# Altium project Super_Hornet_1.0.PrjPcb (part 5 of 5)
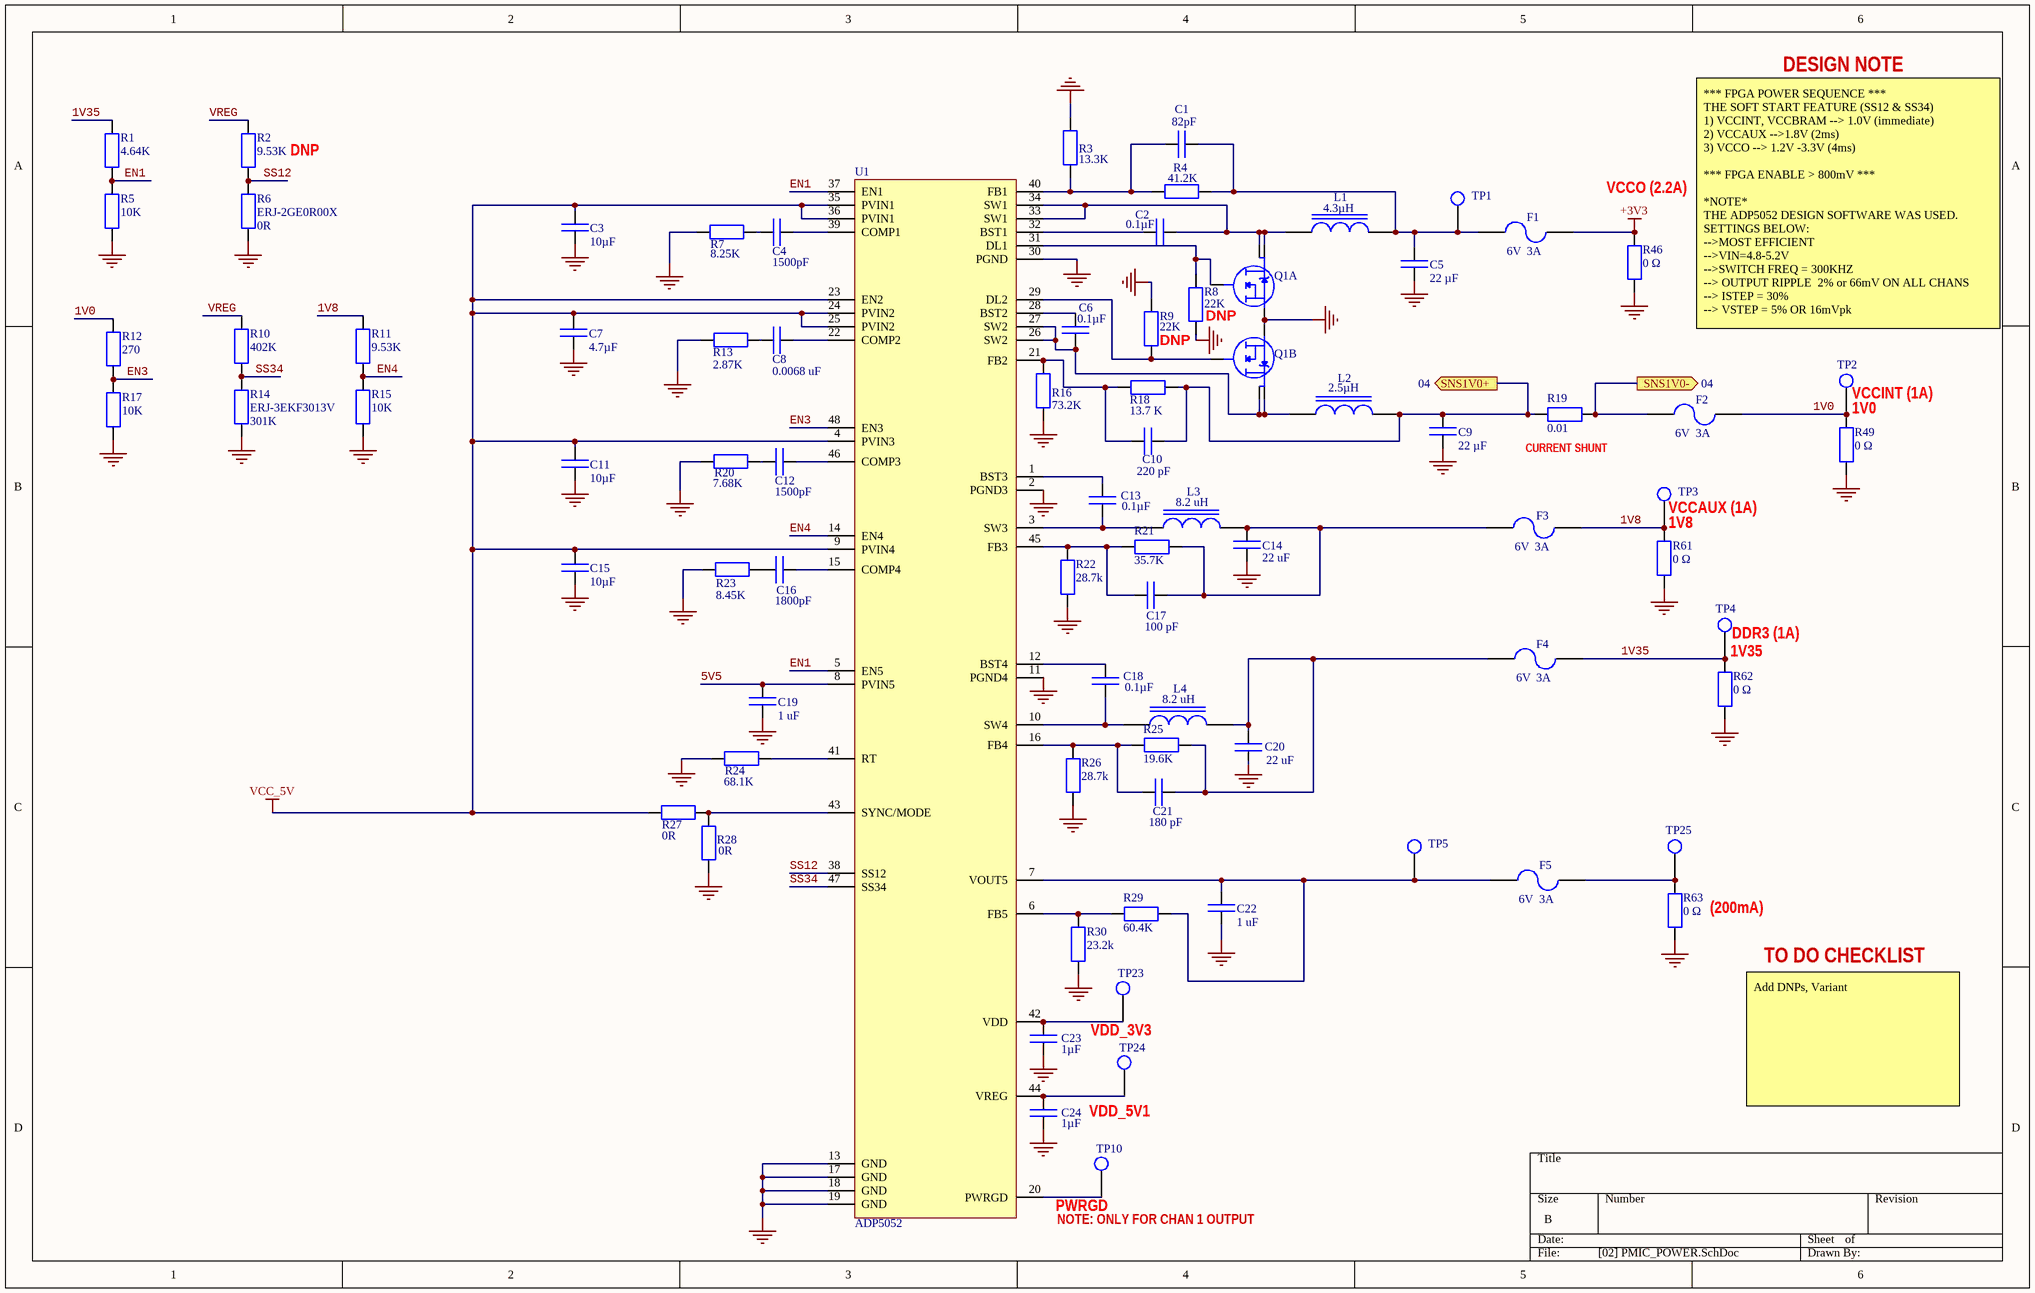
[diagram p6: [02] PMIC_POWER.SchDoc]

## Sheet [02] PMIC_POWER.SchDoc (continued)

### Library data of the parts (continued)
R13 = RC0805FR-072K87L: RES SMD 2.87K OHM 1% 1/8W 0805; Manufacturer: Yageo; Product Training Modules: Chip Resistor; Catalog Drawings: Thick Film Resistor Side; PCN Other: RC/AC 0603/0805/1206 22/Jan/2013; HTML Datasheet: RC Series, L Suffix Datasheet.html; EDA / CAD Models: Download from Accelerated Designs; Power (Watts): 0.125W, 1/8W; Temperature Coefficient: ±100ppm/°C; Online Catalog: RC0805 Series; Kits: PHC4A-KIT-ND  - RES KIT 1K-9.76K 1/8W 5700PCS PHC4-KIT-ND  - RES KIT 1K-9.76K 1/8W 22800PCS; Other Names: 311-2.87KCRCT; Supplier 1: Digi-Key; Manufacturer Part Number: RC0805FR-072K87L; Stock 1: 149027; Pricing 1: 1=0.1, 10=0.04, 100=0.0163, 1000=0.0073, 2500=0.0064 (USD); Standard Package: 1; Category: Resistors; Family: Chip Resistor - Surface Mount; Series: RC; Packaging: Cut Tape (CT); Tolerance: ±1%; Composition: Thick Film; Features: Moisture Resistant; Operating Temperature: -55°C ~ 155°C; Package / Case: 0805 (2012 Metric); Supplier Device Package: 0805; Size / Dimension: 0.079" L x 0.049" W (2.00mm x 1.25mm); Height: 0.024" (0.60mm); Number of Terminations: 2; ComponentLink1URL: http://www.yageo.ru/pdf/RC0805.pdf?src-supplier=Future+Electronics; ComponentLink1Description: http://www.yageo.ru/pdf/RC0805.pdf?src-supplier=Future+Electronics; ComponentLink2URL: http://www.yageo.com.tw/exep/pages/download/literatures/PYu-R_INT-thick_7.pdf?src-supplier=Digi-Key; ComponentLink2Description: http://www.yageo.com.tw/exep/pages/download/literatures/PYu-R_INT-thick_7.pdf?src-supplier=Digi-Key; ComponentLink3URL: http://www.yageo.com/documents/recent/PYu-RC_Group_51_RoHS_L_9.pdf?src-supplier=Digi-Key; ComponentLink3Description: http://www.yageo.com/documents/recent/PYu-RC_Group_51_RoHS_L_9.pdf?src-supplier=Digi-Key; Supplier Part Number 1: 311-2.87KCRCT-ND
R14 = ERJ-3EKF3013V: RES SMD 301K OHM 1% 1/10W 0603; Manufacturer: Panasonic; Resistor Element Type: Thick Film; Temperature Coefficient: ± 100ppm/°C; SVHC: To Be Advised; Product Range: PANASONIC - ERJ Series Thick Film Chip Resistors; Power Rating: 100mW; Resistor Case Style: 0603 ^1608 Metric]; Voltage Rating: 75V; Supplier 1: Digi-Key; Manufacturer Part Number: ERJ-3EKF3013V; Stock 1: 56159; Pricing 1: 1=0.1, 10=0.05, 100=0.0205, 1000=0.0092, 2500=0.008 (USD); Packaging: Full Reel; Resistance Tolerance: ± 1%; ComponentLink1URL: http://www.jameco.com/Jameco/Products/ProdDS/1987951.pdf?src-supplier=Jameco; ComponentLink1Description: http://www.jameco.com/Jameco/Products/ProdDS/1987951.pdf?src-supplier=Jameco; ComponentLink2URL: http://industrial.panasonic.com/www-data/pdf/AOA0000/AOA0000CE2.pdf?src-supplier=Avnet; ComponentLink2Description: http://industrial.panasonic.com/www-data/pdf/AOA0000/AOA0000CE2.pdf?src-supplier=Avnet; ComponentLink3URL: https://www.alliedelec.com/m/d/623f45ff1957d936ff56d46fd1c28cac.pdf?src-supplier=Allied+Electronics; ComponentLink3Description: https://www.alliedelec.com/m/d/623f45ff1957d936ff56d46fd1c28cac.pdf?src-supplier=Allied+Electronics; ComponentLink4URL: http://www.farnell.com/datasheets/426256.pdf?src-supplier=Element14; ComponentLink4Description: http://www.farnell.com/datasheets/426256.pdf?src-supplier=Element14; ComponentLink5URL: http://www.farnell.com/datasheets/1678782.pdf?src-supplier=Element14; ComponentLink5Description: http://www.farnell.com/datasheets/1678782.pdf?src-supplier=Element14; ComponentLink6URL: http://www.farnell.com/datasheets/426256.pdf?src-supplier=Farnell; ComponentLink6Description: http://www.farnell.com/datasheets/426256.pdf?src-supplier=Farnell; ComponentLink7URL: http://www.mouser.com/ds/2/315/AOA0000C283-1093288.pdf?src-supplier=Mouser; ComponentLink7Description: http://www.mouser.com/ds/2/315/AOA0000C283-1093288.pdf?src-supplier=Mouser; Supplier Part Number 1: P301KHCT-ND
R16 = ERJ-2RKF7322X: RES SMD 73.2K OHM 1% 1/10W 0402; Manufacturer: Panasonic; Temperature Coefficient: ± 100ppm/°C; Voltage Rating: 50V; SVHC: To Be Advised; Product Range: PANASONIC - ERJ Series; Power Rating: 100mW; Resistor Case Style: 0402 ^1005 Metric]; Resistor Element Type: Thick Film; Supplier 1: Digi-Key; Manufacturer Part Number: ERJ-2RKF7322X; Stock 1: 75939; Pricing 1: 1=0.1, 10=0.04, 100=0.0164, 1000=0.0074, 2500=0.0064, 5000=0.0053 (USD); Packaging: Full Reel; Resistance Tolerance: ± 1%; ComponentLink1URL: https://www.alliedelec.com/m/d/623f45ff1957d936ff56d46fd1c28cac.pdf?src-supplier=Allied+Electronics; ComponentLink1Description: https://www.alliedelec.com/m/d/623f45ff1957d936ff56d46fd1c28cac.pdf?src-supplier=Allied+Electronics; ComponentLink2URL: http://www.mouser.com/ds/2/315/AOA0000CE2-37512.pdf?src-supplier=Mouser; ComponentLink2Description: http://www.mouser.com/ds/2/315/AOA0000CE2-37512.pdf?src-supplier=Mouser; ComponentLink3URL: http://www.farnell.com/datasheets/1678782.pdf?src-supplier=Element14; ComponentLink3Description: http://www.farnell.com/datasheets/1678782.pdf?src-supplier=Element14; ComponentLink4URL: http://www.industrial.panasonic.com/www-data/pdf/AOA0000/AOA0000CE2.pdf?src-supplier=Element14; ComponentLink4Description: http://www.industrial.panasonic.com/www-data/pdf/AOA0000/AOA0000CE2.pdf?src-supplier=Element14; ComponentLink5URL: http://www.farnell.com/datasheets/1911175.pdf?src-supplier=Farnell; ComponentLink5Description: http://www.farnell.com/datasheets/1911175.pdf?src-supplier=Farnell; Supplier Part Number 1: P73.2KLCT-ND
R18 = ERJ-2RKF1372X: RES SMD 13.7K OHM 1% 1/10W 0402; Manufacturer: Panasonic; Power Rating: 100 mW; Temperature Coefficient: 100 PPM / C; Voltage Rating: 50 V; Qualification: AEC-Q200; Unit Weight: 0.000028 oz; Supplier 1: Digi-Key; Manufacturer Part Number: ERJ-2RKF1372X; Stock 1: 348733; Pricing 1: 1=0.1, 10=0.043, 100=0.0173, 1000=0.0078, 2500=0.0068, 5000=0.0056 (USD); Product Category: Thick Film Resistors; RoHS: True; Tolerance: 1 %; Case Code - in: 0402; Case Code - mm: 1005; Operating Temperature Range: - 55 C to + 155 C; Series: ERJ; Type: Precision Thick Film Resistors SMD; Brand: Panasonic; Height: 0.35 mm; Length: 1 mm; Package / Case: 0402 (1005 metric); Packaging: Reel; Product: Thick Film Resistors SMD; Factory Pack Quantity: 10000; Termination Style: SMD/SMT; Width: 0.5 mm; ComponentLink1URL: http://www.farnell.com/datasheets/1678782.pdf?src-supplier=Element14; ComponentLink1Description: http://www.farnell.com/datasheets/1678782.pdf?src-supplier=Element14; ComponentLink2URL: http://www.farnell.com/datasheets/1694929.pdf?src-supplier=Element14; ComponentLink2Description: http://www.farnell.com/datasheets/1694929.pdf?src-supplier=Element14; ComponentLink3URL: https://www.alliedelec.com/m/d/623f45ff1957d936ff56d46fd1c28cac.pdf?src-supplier=Allied+Electronics; ComponentLink3Description: https://www.alliedelec.com/m/d/623f45ff1957d936ff56d46fd1c28cac.pdf?src-supplier=Allied+Electronics; ComponentLink4URL: http://www.farnell.com/datasheets/1678782.pdf?src-supplier=Farnell; ComponentLink4Description: http://www.farnell.com/datasheets/1678782.pdf?src-supplier=Farnell; ComponentLink5URL: http://industrial.panasonic.com/www-data/pdf/AOA0000/AOA0000CE2.pdf?src-supplier=Avnet; ComponentLink5Description: http://industrial.panasonic.com/www-data/pdf/AOA0000/AOA0000CE2.pdf?src-supplier=Avnet; ComponentLink6URL: http://www.mouser.com/ds/2/315/AOA0000C304-1149620.pdf?src-supplier=Mouser; ComponentLink6Description: http://www.mouser.com/ds/2/315/AOA0000C304-1149620.pdf?src-supplier=Mouser; Supplier Part Number 1: P13.7KLCT-ND
R19 = ERJ-3LWFR010V: RES SMD 0.01 OHM 1% 1/4W 0603; Manufacturer: Panasonic; Power (Watts): 0.25W, 1/4W; Temperature Coefficient: 0/ +300ppm/°C; Supplier 1: Digi-Key; Manufacturer Part Number: ERJ-3LWFR010V; Stock 1: 48216; Pricing 1: 1=0.48, 10=0.371, 100=0.156, 1000=0.0861, 2500=0.0807 (USD); Category: Resistors; Family: Chip Resistor - Surface Mount; Series: ERJ; Packaging: Tape & Reel (TR); Tolerance: ±1%; Composition: Thick Film; Features: Automotive AEC-Q200, Current Sense; Operating Temperature: -55°C ~ 125°C; Package / Case: 0603 (1608 Metric); Supplier Device Package: 0603; Size / Dimension: 0.063" L x 0.031" W (1.60mm x 0.80mm); Height: 0.026" (0.65mm); Number of Terminations: 2; ComponentLink1URL: https://industrial.panasonic.com/cdbs/www-data/pdf/RDN0000/AOA0000C313.pdf?src-supplier=Digi-Key; ComponentLink1Description: https://industrial.panasonic.com/cdbs/www-data/pdf/RDN0000/AOA0000C313.pdf?src-supplier=Digi-Key; ComponentLink2URL: http://industrial.panasonic.com/lecs/www-data/pdf/AOA0000/AOA0000CE3.pdf?src-supplier=Digi-Key; ComponentLink2Description: http://industrial.panasonic.com/lecs/www-data/pdf/AOA0000/AOA0000CE3.pdf?src-supplier=Digi-Key; ComponentLink3URL: http://www.mouser.com/ds/2/315/AOA0000C295-1109214.pdf?src-supplier=Mouser; ComponentLink3Description: http://www.mouser.com/ds/2/315/AOA0000C295-1109214.pdf?src-supplier=Mouser; Supplier Part Number 1: P19180CT-ND
R20 = ERJ-6ENF7681V: RES SMD 7.68K OHM 1% 1/8W 0805; Manufacturer: Panasonic; EDA / CAD Models: Download from Accelerated Designs; Power (Watts): 0.125W, 1/8W; Temperature Coefficient: ±100ppm/°C; Online Catalog: ERJ Series; Kits: RSM3CA-ND  - RES KIT 1K-9.76K 1/8W 4800PCS RSM3C-ND  - RES KIT 1K-9.76K 1/8W 19200PCS; Other Names: ERJ-6ENF7681 ERJ6ENF7681 P7.68KCBK P7.68KCCT; Supplier 1: Digi-Key; Manufacturer Part Number: ERJ-6ENF7681V; Stock 1: 41002; Pricing 1: 1=0.1, 10=0.072, 100=0.0275, 1000=0.0121, 2500=0.0105 (USD); Standard Package: 1; Category: Resistors; Family: Chip Resistor - Surface Mount; Series: ERJ; Packaging: Cut Tape (CT); Tolerance: ±1%; Composition: Thick Film; Features: Automotive AEC-Q200; Operating Temperature: -55°C ~ 155°C; Package / Case: 0805 (2012 Metric); Supplier Device Package: 0805; Size / Dimension: 0.079" L x 0.049" W (2.00mm x 1.25mm); Height: 0.028" (0.70mm); Number of Terminations: 2; ComponentLink1URL: http://www.mouser.com/ds/2/315/AOA0000C283-1093288.pdf?src-supplier=Mouser; ComponentLink1Description: http://www.mouser.com/ds/2/315/AOA0000C283-1093288.pdf?src-supplier=Mouser; ComponentLink2URL: https://www.alliedelec.com/m/d/623f45ff1957d936ff56d46fd1c28cac.pdf?src-supplier=Allied+Electronics; ComponentLink2Description: https://www.alliedelec.com/m/d/623f45ff1957d936ff56d46fd1c28cac.pdf?src-supplier=Allied+Electronics; ComponentLink3URL: http://www.farnell.com/datasheets/1678782.pdf?src-supplier=Farnell; ComponentLink3Description: http://www.farnell.com/datasheets/1678782.pdf?src-supplier=Farnell; ComponentLink4URL: http://industrial.panasonic.com/www-data/pdf/AOA0000/AOA0000CE2.pdf?src-supplier=Avnet; ComponentLink4Description: http://industrial.panasonic.com/www-data/pdf/AOA0000/AOA0000CE2.pdf?src-supplier=Avnet; ComponentLink5URL: http://www.farnell.com/datasheets/1694929.pdf?src-supplier=Element14; ComponentLink5Description: http://www.farnell.com/datasheets/1694929.pdf?src-supplier=Element14; Supplier Part Number 1: P7.68KCCT-ND
R21 = ERJ-2RKF3572X: RES SMD 35.7K OHM 1% 1/10W 0402; Manufacturer: Panasonic; Resistor Element Type: Thick Film; Product Range: PANASONIC - ERJ Series; Power Rating: 100mW; Resistor Case Style: 0402 [1005 Metric]; Temperature Coefficient: ± 100ppm/°C; Voltage Rating: 50V; SVHC: Diboron trioxide (19-Dec-2012); Resistor Terminals: Wraparound; SVHC (Secondary): Lead monoxide (lead oxide) (19-Dec-2012); Supplier 1: Digi-Key; Manufacturer Part Number: ERJ-2RKF3572X; Stock 1: 130211; Pricing 1: 1=0.1, 10=0.038, 100=0.0153, 1000=0.0069, 2500=0.006, 5000=0.0049 (USD); Resistance Tolerance: ± 1%; Resistor Element Material: Thick Film; Packaging: Cut Tape; MSL: (Not Applicable); Resistor Mounting: SMD; ComponentLink1URL: http://industrial.panasonic.com/www-data/pdf/AOA0000/AOA0000CE2.pdf?src-supplier=Avnet; ComponentLink1Description: http://industrial.panasonic.com/www-data/pdf/AOA0000/AOA0000CE2.pdf?src-supplier=Avnet; ComponentLink2URL: http://www.mouser.com/ds/2/315/AOA0000C86-911473.pdf?src-supplier=Mouser; ComponentLink2Description: http://www.mouser.com/ds/2/315/AOA0000C86-911473.pdf?src-supplier=Mouser; ComponentLink3URL: http://www.industrial.panasonic.com/www-data/pdf/AOA0000/AOA0000CE2.pdf?src-supplier=Element14; ComponentLink3Description: http://www.industrial.panasonic.com/www-data/pdf/AOA0000/AOA0000CE2.pdf?src-supplier=Element14; ComponentLink4URL: https://www.alliedelec.com/m/d/623f45ff1957d936ff56d46fd1c28cac.pdf?src-supplier=Allied+Electronics; ComponentLink4Description: https://www.alliedelec.com/m/d/623f45ff1957d936ff56d46fd1c28cac.pdf?src-supplier=Allied+Electronics; ComponentLink5URL: http://www.farnell.com/datasheets/1694929.pdf?src-supplier=Element14; ComponentLink5Description: http://www.farnell.com/datasheets/1694929.pdf?src-supplier=Element14; Supplier Part Number 1: P35.7KLCT-ND
R22 R26 = CRCW040228K7FKED: RES SMD 28.7K OHM 1% 1/16W 0402; Manufacturer: Vishay; EDA / CAD Models: Download from Accelerated Designs; Power (Watts): 0.063W, 1/16W; Temperature Coefficient: ±100ppm/°C; Online Catalog: CRCW - Automotive Series; Kits: 541-1418-ND  - RESISTOR KIT 0-1M 1/16W 12200PCS; Other Names: 541-28.7KLCT; Supplier 1: Digi-Key; Manufacturer Part Number: CRCW040228K7FKED; Stock 1: 9780; Pricing 1: 1=0.1, 10=0.036, 100=0.0146, 1000=0.0066, 2500=0.0057, 5000=0.0047 (USD); Standard Package: 10; Category: Resistors; Family: Chip Resistor - Surface Mount; Series: CRCW; Packaging: Cut Tape (CT); Tolerance: ±1%; Composition: Thick Film; Features: Automotive AEC-Q200; Operating Temperature: -55°C ~ 155°C; Package / Case: 0402 (1005 Metric); Supplier Device Package: 0402 (1005 Metric); Size / Dimension: 0.039" L x 0.020" W (1.00mm x 0.50mm); Height: 0.016" (0.40mm); Number of Terminations: 2; ComponentLink1URL: http://www.farnell.com/datasheets/2111203.pdf?src-supplier=Element14; ComponentLink1Description: http://www.farnell.com/datasheets/2111203.pdf?src-supplier=Element14; ComponentLink2URL: http://uk.rs-online.com/webdocs/0d98/0900766b80d98824.pdf?src-supplier=RSComponents; ComponentLink2Description: http://uk.rs-online.com/webdocs/0d98/0900766b80d98824.pdf?src-supplier=RSComponents; ComponentLink3URL: https://www.alliedelec.com/m/d/0c934d6939ccefa68dbe0b96d821c8cf.pdf?src-supplier=Allied+Electronics; ComponentLink3Description: https://www.alliedelec.com/m/d/0c934d6939ccefa68dbe0b96d821c8cf.pdf?src-supplier=Allied+Electronics; ComponentLink4URL: http://www.farnell.com/datasheets/2045674.pdf?src-supplier=Element14; ComponentLink4Description: http://www.farnell.com/datasheets/2045674.pdf?src-supplier=Element14; ComponentLink5URL: http://www.vishay.com/docs/20035/dcrcwe3.pdf?src-supplier=Digi-Key; ComponentLink5Description: http://www.vishay.com/docs/20035/dcrcwe3.pdf?src-supplier=Digi-Key; ComponentLink6URL: http://www.vishay.com/docs/20035/dcrcwe3.pdf?src-supplier=Avnet+Europe; ComponentLink6Description: http://www.vishay.com/docs/20035/dcrcwe3.pdf?src-supplier=Avnet+Europe; ComponentLink7URL: http://www.farnell.com/datasheets/1697337.pdf?src-supplier=Element14; ComponentLink7Description: http://www.farnell.com/datasheets/1697337.pdf?src-supplier=Element14; ComponentLink8URL: http://www.vishay.com/docs/20035/dcrcwe3.pdf?src-supplier=Future+Electronics; ComponentLink8Description: http://www.vishay.com/docs/20035/dcrcwe3.pdf?src-supplier=Future+Electronics; Supplier Part Number 1: 541-28.7KLCT-ND
R23 = ERJ-6ENF8451V: RES SMD 8.45K OHM 1% 1/8W 0805; Manufacturer: Panasonic; Temperature Coefficient: ± 100ppm/°C; Voltage Rating: 150V; SVHC: To Be Advised; Product Range: PANASONIC - ERJ Series; Power Rating: 125mW; Resistor Case Style: 0805 ^2012 Metric]; Resistor Element Type: Thick Film; Supplier 1: Digi-Key; Manufacturer Part Number: ERJ-6ENF8451V; Stock 1: 16020; Pricing 1: 1=0.1, 10=0.072, 100=0.0275, 1000=0.0121, 2500=0.0105 (USD); Packaging: Full Reel; Resistance Tolerance: ± 1%; ComponentLink1URL: http://www.mouser.com/ds/2/315/AOA0000CE2-37512.pdf?src-supplier=Mouser; ComponentLink1Description: http://www.mouser.com/ds/2/315/AOA0000CE2-37512.pdf?src-supplier=Mouser; ComponentLink2URL: https://www.alliedelec.com/m/d/623f45ff1957d936ff56d46fd1c28cac.pdf?src-supplier=Allied+Electronics; ComponentLink2Description: https://www.alliedelec.com/m/d/623f45ff1957d936ff56d46fd1c28cac.pdf?src-supplier=Allied+Electronics; ComponentLink3URL: http://components.arrow.com/part/dataview/3985858S182954N1386?src-supplier=Arrow; ComponentLink3Description: http://components.arrow.com/part/dataview/3985858S182954N1386?src-supplier=Arrow; Supplier Part Number 1: P8.45KCCT-ND
R24 = ERJ-2RKF6812X: RES SMD 68.1K OHM 1% 1/10W 0402; Manufacturer: Panasonic; Rated Power: 0.1 W; Temp Coefficient: ±100 ppm/°C; Supplier 1: Digi-Key; Manufacturer Part Number: ERJ-2RKF6812X; Stock 1: 216250; Pricing 1: 1=0.1, 10=0.04, 100=0.0164, 1000=0.0074, 2500=0.0064, 5000=0.0053 (USD); Size Code: 0402; Tolerance (%): ±1 %; ComponentLink1URL: http://www.farnell.com/datasheets/1678782.pdf?src-supplier=Element14; ComponentLink1Description: http://www.farnell.com/datasheets/1678782.pdf?src-supplier=Element14; ComponentLink2URL: http://industrial.panasonic.com/www-data/pdf/AOA0000/AOA0000CE2.pdf?src-supplier=Avnet; ComponentLink2Description: http://industrial.panasonic.com/www-data/pdf/AOA0000/AOA0000CE2.pdf?src-supplier=Avnet; ComponentLink3URL: https://www.alliedelec.com/m/d/623f45ff1957d936ff56d46fd1c28cac.pdf?src-supplier=Allied+Electronics; ComponentLink3Description: https://www.alliedelec.com/m/d/623f45ff1957d936ff56d46fd1c28cac.pdf?src-supplier=Allied+Electronics; ComponentLink4URL: http://industrial.panasonic.com/www-data/pdf/AOA0000/AOA0000CE2.pdf?src-supplier=Future+Electronics; ComponentLink4Description: http://industrial.panasonic.com/www-data/pdf/AOA0000/AOA0000CE2.pdf?src-supplier=Future+Electronics; ComponentLink5URL: http://www.farnell.com/datasheets/1694929.pdf?src-supplier=Element14; ComponentLink5Description: http://www.farnell.com/datasheets/1694929.pdf?src-supplier=Element14; Supplier Part Number 1: P68.1KLCT-ND
R25 = ERJ-2RKF1962X: RES SMD 19.6K OHM 1% 1/10W 0402; Manufacturer: Panasonic; Resistor Element Type: Thick Film; Product Range: PANASONIC - ERJ Series; Power Rating: 100mW; Resistor Case Style: 0402 [1005 Metric]; Temperature Coefficient: ± 100ppm/°C; Voltage Rating: 50V; SVHC: Diboron trioxide (19-Dec-2012); Resistor Terminals: Wraparound; SVHC (Secondary): Lead monoxide (lead oxide) (19-Dec-2012); Supplier 1: Digi-Key; Manufacturer Part Number: ERJ-2RKF1962X; Stock 1: 262661; Pricing 1: 1=0.1, 10=0.044, 100=0.018, 1000=0.0081, 2500=0.007, 5000=0.0058 (USD); Resistance Tolerance: ± 1%; Resistor Element Material: Thick Film; Packaging: Cut Tape; MSL: (Not Applicable); Resistor Mounting: SMD; ComponentLink1URL: http://www.mouser.com/ds/2/315/AOA0000C283-1093288.pdf?src-supplier=Mouser; ComponentLink1Description: http://www.mouser.com/ds/2/315/AOA0000C283-1093288.pdf?src-supplier=Mouser; ComponentLink2URL: http://industrial.panasonic.com/www-data/pdf/AOA0000/AOA0000CE2.pdf?src-supplier=Avnet; ComponentLink2Description: http://industrial.panasonic.com/www-data/pdf/AOA0000/AOA0000CE2.pdf?src-supplier=Avnet; ComponentLink3URL: https://www.alliedelec.com/m/d/623f45ff1957d936ff56d46fd1c28cac.pdf?src-supplier=Allied+Electronics; ComponentLink3Description: https://www.alliedelec.com/m/d/623f45ff1957d936ff56d46fd1c28cac.pdf?src-supplier=Allied+Electronics; ComponentLink4URL: http://www.farnell.com/datasheets/1911175.pdf?src-supplier=Element14; ComponentLink4Description: http://www.farnell.com/datasheets/1911175.pdf?src-supplier=Element14; ComponentLink5URL: http://www.farnell.com/datasheets/1694929.pdf?src-supplier=Element14; ComponentLink5Description: http://www.farnell.com/datasheets/1694929.pdf?src-supplier=Element14; ComponentLink6URL: http://www.farnell.com/datasheets/1911175.pdf?src-supplier=Farnell; ComponentLink6Description: http://www.farnell.com/datasheets/1911175.pdf?src-supplier=Farnell; Supplier Part Number 1: P19.6KLCT-ND
R29 = ERJ-2RKF6042X: RES SMD 60.4K OHM 1% 1/10W 0402; Manufacturer: Panasonic; Resistor Element Type: Thick Film; Temperature Coefficient: ± 100ppm/°C; Voltage Rating: 50V; SVHC: To Be Advised; Product Range: PANASONIC - ERJ Series Thick Film Chip Resistors; Power Rating: 63mW; Resistor Case Style: 0402 ^1005 Metric]; Supplier 1: Digi-Key; Manufacturer Part Number: ERJ-2RKF6042X; Stock 1: 597601; Pricing 1: 1=0.1, 10=0.04, 100=0.0163, 1000=0.0073, 2500=0.0064, 5000=0.0053 (USD); Packaging: Full Reel; Resistance Tolerance: ± 1%; ComponentLink1URL: http://www.farnell.com/datasheets/1911175.pdf?src-supplier=Farnell; ComponentLink1Description: http://www.farnell.com/datasheets/1911175.pdf?src-supplier=Farnell; ComponentLink2URL: http://industrial.panasonic.com/www-data/pdf/AOA0000/AOA0000CE2.pdf?src-supplier=Avnet; ComponentLink2Description: http://industrial.panasonic.com/www-data/pdf/AOA0000/AOA0000CE2.pdf?src-supplier=Avnet; ComponentLink3URL: http://industrial.panasonic.com/www-data/pdf/AOA0000/AOA0000CE2.pdf?src-supplier=Avnet+Asia; ComponentLink3Description: http://industrial.panasonic.com/www-data/pdf/AOA0000/AOA0000CE2.pdf?src-supplier=Avnet+Asia; ComponentLink4URL: https://www.alliedelec.com/m/d/623f45ff1957d936ff56d46fd1c28cac.pdf?src-supplier=Allied+Electronics; ComponentLink4Description: https://www.alliedelec.com/m/d/623f45ff1957d936ff56d46fd1c28cac.pdf?src-supplier=Allied+Electronics; ComponentLink5URL: http://www.farnell.com/datasheets/1678782.pdf?src-supplier=Element14; ComponentLink5Description: http://www.farnell.com/datasheets/1678782.pdf?src-supplier=Element14; ComponentLink6URL: http://www.mouser.com/ds/2/315/AOA0000C283-1093288.pdf?src-supplier=Mouser; ComponentLink6Description: http://www.mouser.com/ds/2/315/AOA0000C283-1093288.pdf?src-supplier=Mouser; ComponentLink7URL: http://www.farnell.com/datasheets/1911175.pdf?src-supplier=Element14; ComponentLink7Description: http://www.farnell.com/datasheets/1911175.pdf?src-supplier=Element14; ComponentLink8URL: http://industrial.panasonic.com/cdbs/www-data/pdf/RDA0000/AOA0000C304.pdf?src-supplier=Farnell; ComponentLink8Description: http://industrial.panasonic.com/cdbs/www-data/pdf/RDA0000/AOA0000C304.pdf?src-supplier=Farnell; Supplier Part Number 1: P60.4KLCT-ND
R30 = ERJ-2RKF2322X: RES SMD 23.2K OHM 1% 1/10W 0402; Manufacturer: Panasonic; EDA / CAD Models: Download from Accelerated Designs; Power (Watts): 0.1W, 1/10W; Temperature Coefficient: ±100ppm/°C; Online Catalog: ERJ Series; Kits: RSM4L-ND  - RES KIT 10K-97.6K 1/10W 4800PCS; Other Names: ERJ-2RKF2322 ERJ2RKF2322 P23.2KLCT; Supplier 1: Digi-Key; Manufacturer Part Number: ERJ-2RKF2322X; Stock 1: 325477; Pricing 1: 1=0.1, 10=0.047, 100=0.0192, 1000=0.0086, 2500=0.0075, 5000=0.0062 (USD); Standard Package: 1; Category: Resistors; Family: Chip Resistor - Surface Mount; Series: ERJ; Packaging: Cut Tape (CT); Tolerance: ±1%; Composition: Thick Film; Features: Automotive AEC-Q200; Operating Temperature: -55°C ~ 155°C; Package / Case: 0402 (1005 Metric); Supplier Device Package: 0402; Size / Dimension: 0.039" L x 0.020" W (1.00mm x 0.50mm); Height: 0.016" (0.40mm); Number of Terminations: 2; ComponentLink1URL: https://www.alliedelec.com/m/d/623f45ff1957d936ff56d46fd1c28cac.pdf?src-supplier=Allied+Electronics; ComponentLink1Description: https://www.alliedelec.com/m/d/623f45ff1957d936ff56d46fd1c28cac.pdf?src-supplier=Allied+Electronics; ComponentLink2URL: http://www.farnell.com/datasheets/1911175.pdf?src-supplier=Farnell; ComponentLink2Description: http://www.farnell.com/datasheets/1911175.pdf?src-supplier=Farnell; ComponentLink3URL: http://www.farnell.com/datasheets/1678782.pdf?src-supplier=Element14; ComponentLink3Description: http://www.farnell.com/datasheets/1678782.pdf?src-supplier=Element14; ComponentLink4URL: http://www.mouser.com/ds/2/315/AOA0000C283-1093288.pdf?src-supplier=Mouser; ComponentLink4Description: http://www.mouser.com/ds/2/315/AOA0000C283-1093288.pdf?src-supplier=Mouser; Supplier Part Number 1: P23.2KLCT-ND
R46 R49 R61-R63 = ERJ-6GEY0R00V: RES SMD 0 OHM JUMPER 1/8W 0805; Manufacturer: Panasonic; Rated Power: 0.125 W; Rated Current: 2 A; No. of Terminations: 2; Supplier 1: Digi-Key; Manufacturer Part Number: ERJ-6GEY0R00V; Stock 1: 1318594; Pricing 1: 1=0.1, 10=0.054, 25=0.0392, 50=0.03, 100=0.0221, 250=0.0168, 500=0.0135, 1000=0.0099 (USD); Technology: Thick Film; Operating Temp Range: -55 to +155 °C; Case Size: 0805 (2012 Metric); Dimension: 2 x 1.25 mm; Height - Max: 0.7 mm; ComponentLink1URL: http://www.farnell.com/datasheets/1678796.pdf?src-supplier=Element14; ComponentLink1Description: http://www.farnell.com/datasheets/1678796.pdf?src-supplier=Element14; ComponentLink2URL: http://industrial.panasonic.com/cdbs/www-data/pdf/RDA0000/AOA0000C301.pdf?src-supplier=Farnell; ComponentLink2Description: http://industrial.panasonic.com/cdbs/www-data/pdf/RDA0000/AOA0000C301.pdf?src-supplier=Farnell; ComponentLink3URL: http://industrial.panasonic.com/www-data/pdf/AOA0000/AOA0000CE1.pdf?src-supplier=Avnet; ComponentLink3Description: http://industrial.panasonic.com/www-data/pdf/AOA0000/AOA0000CE1.pdf?src-supplier=Avnet; ComponentLink4URL: http://industrial.panasonic.com/www-cgi/jvcr13pz.cgi?E+PZ+3+AOA0001+ERJ6GEY0R00V+7+WW?src-supplier=Jameco; ComponentLink4Description: http://industrial.panasonic.com/www-cgi/jvcr13pz.cgi?E+PZ+3+AOA0001+ERJ6GEY0R00V+7+WW?src-supplier=Jameco; ComponentLink5URL: http://industrial.panasonic.com/www-data/pdf/AOA0000/AOA0000CE1.pdf?src-supplier=Avnet+Europe; ComponentLink5Description: http://industrial.panasonic.com/www-data/pdf/AOA0000/AOA0000CE1.pdf?src-supplier=Avnet+Europe; ComponentLink6URL: http://industrial.panasonic.com/www-data/pdf/AOA0000/AOA0000CE1.pdf?src-supplier=Avnet+Asia; ComponentLink6Description: http://industrial.panasonic.com/www-data/pdf/AOA0000/AOA0000CE1.pdf?src-supplier=Avnet+Asia; Supplier Part Number 1: P0.0ACT-ND
TP1-TP5 TP10 TP23-TP25 = 5017: PCB MINI TEST POINT; Manufacturer: Keystone Electronics; Minimum Quantity: PC Test Point, Miniature; Dynamic Catalog: Surface Mount Test Points; Featured Product: 5019 Miniature Surface Mount Test Point; Other Names: 5017-ND / 5017KTR / Q5021014; Supplier 1: Digi-Key; Manufacturer Part Number: 5017; Stock 1: 285000; Pricing 1: 5000=0.0924 (USD); Quantity Available: Tape & Reel (TR)Alternate Packaging; RoHS Information: RoHS Compliance Statement; Standard Package: 5,000; Category: Test and Measurement; Family: Test Points; Packaging: Tape & Reel (TR); Type: PC Test Point, Miniature; Terminal: 0.010" (0.25mm) Phosphor Bronze, Silver Plated; Mounting Type: Surface Mount; Material: Phosphor Bronze; Online Catalog: Surface Mount Test Points; ComponentLink1URL: http://www.keyelco.com/product-pdf.cfm?p=1355&src-supplier=Digi-Key; ComponentLink1Description: http://www.keyelco.com/product-pdf.cfm?p=1355&src-supplier=Digi-Key; Supplier Part Number 1: 36-5017TR-NDL
U1 = ADP5052ACPZ-R7: PMIC 4BUCK_1LDO; Manufacturer: Analog Devices; Minimum Quantity: Step-Down (Buck) Synchronous (5), Linear (LDO) (1); Dynamic Catalog: Linear + Switching; Featured Product: 2nd Quarter Select Products; PCN Design/Specification: ADP5050/ADP5052 Die Revision 06/Jan/2014; PCN Assembly/Origin: Assembly and Test Transfer LFCSP Devices 22/Oct/2013 / Assembly/Test Site Revision D 06/Aug/2014; Topology: Step-Down (Buck) Synchronous (4), Linear (LDO) (1); Function: Any Function; Number of Outputs: 5; Frequency - Switching: 740kHz; Voltage/Current - Output 1: 0.85 V ~ 1.6 V, PROG; Voltage/Current - Output 2: 3.3 V ~ 5 V, PROG; Voltage/Current - Output 3: 1.2 V ~ 1.8 V, 1.2A; w/LED Driver: No; Voltage - Supply: 4.5 V ~ 15 V; For Use With: ADP5052-EVALZ-ND / - EVAL BOARD BUCK REG/LDO ADP5052; Other Names: ADP5052ACPZ-R7CT; Resistor Element Type: Thick Film; Product Range: PANASONIC - ERJ Series; Resistance: 3.65kohm; Power Rating: 100mW; Resistance Tolerance: ± 1%; Resistor Case Style: 0402 [1005 Metric]; Temperature Coefficient: ± 100ppm/°C; Voltage Rating: 50V; SVHC: Diboron trioxide (19-Dec-2012); Resistor Mounting: SMD; Resistor Terminals: Wraparound; SVHC (Secondary): Lead monoxide (lead oxide) (19-Dec-2012); Supplier 1: Digi-Key; Manufacturer Part Number: ADP5052ACPZ-R7; Stock 1: 0; Pricing 1: 1=8.54, 10=7.719, 25=7.3596, 100=6.103, 250=5.5645 (USD); Quantity Available: Cut Tape (CT)Alternate Packaging; Package/Case: 48-WFQFN Exposed Pad, CSP; Standard Package: 1; Category: Integrated Circuits (ICs); Family: PMIC - Voltage Regulators - Linear + Switching; Packaging: Cut Tape (CT); w/Supervisor: No; w/Sequencer: No; Operating Temperature: -40°C ~ 125°C; Mounting Type: Surface Mount; Package / Case: 48-WFQFN Exposed Pad, CSP; Supplier Device Package: 48-LFCSP-WQ (7x7); Online Catalog: Linear + Switching; ComponentLink1URL: http://www.mouser.com/ds/2/609/ADP5052-878958.pdf?src-supplier=Mouser; ComponentLink1Description: http://www.mouser.com/ds/2/609/ADP5052-878958.pdf?src-supplier=Mouser; ComponentLink2URL: http://uk.rs-online.com/webdocs/1492/0900766b81492551.pdf?src-supplier=RSComponents; ComponentLink2Description: http://uk.rs-online.com/webdocs/1492/0900766b81492551.pdf?src-supplier=RSComponents; ComponentLink3URL: http://www.analog.com/media/en/technical-documentation/data-sheets/ADP5052.PDF?src-supplier=Digi-Key; ComponentLink3Description: http://www.analog.com/media/en/technical-documentation/data-sheets/ADP5052.PDF?src-supplier=Digi-Key; ComponentLink4URL: http://www.analog.com/static/imported-files/data_sheets/ADP5052.PDF?src-supplier=Avnet; ComponentLink4Description: http://www.analog.com/static/imported-files/data_sheets/ADP5052.PDF?src-supplier=Avnet; ComponentLink5URL: https://www.analog.com/media/en/technical-documentation/data-sheets/ADP5052.PDF?src-supplier=Digi-Key; ComponentLink5Description: https://www.analog.com/media/en/technical-documentation/data-sheets/ADP5052.PDF?src-supplier=Digi-Key; ComponentLink6URL: http://www.produktinfo.conrad.com/datenblaetter/1200000-1299999/001251707-da-01-en-IC_REG_5OUT_ADP5052ACPZ_R7_LFCSP_48_ADI.pdf?src-supplier=Conrad; ComponentLink6Description: http://www.produktinfo.conrad.com/datenblaetter/1200000-1299999/001251707-da-01-en-IC_REG_5OUT_ADP5052ACPZ_R7_LFCSP_48_ADI.pdf?src-supplier=Conrad; Supplier Part Number 1: ADP5052ACPZ-R7CT-ND; Supplier 2: Digi-Key; Stock 2: 78045; Pricing 2: 1=0.1, 10=0.041, 100=0.0166, 1000=0.0075, 2500=0.0065, 5000=0.0054 (USD); Resistor Element Material: Thick Film; MSL: (Not Applicable); ComponentLink7URL: http://industrial.panasonic.com/www-data/pdf/AOA0000/AOA0000CE2.pdf?src-supplier=Avnet; ComponentLink7Description: http://industrial.panasonic.com/www-data/pdf/AOA0000/AOA0000CE2.pdf?src-supplier=Avnet; ComponentLink8URL: http://www.mouser.com/ds/2/315/AOA0000C283-1093288.pdf?src-supplier=Mouser; ComponentLink8Description: http://www.mouser.com/ds/2/315/AOA0000C283-1093288.pdf?src-supplier=Mouser; ComponentLink9URL: http://www.farnell.com/datasheets/1694929.pdf?src-supplier=Element14; ComponentLink9Description: http://www.farnell.com/datasheets/1694929.pdf?src-supplier=Element14; ComponentLink10URL: https://www.alliedelec.com/m/d/623f45ff1957d936ff56d46fd1c28cac.pdf?src-supplier=Allied+Electronics; ComponentLink10Description: https://www.alliedelec.com/m/d/623f45ff1957d936ff56d46fd1c28cac.pdf?src-supplier=Allied+Electronics; ComponentLink11URL: http://www.farnell.com/datasheets/1678782.pdf?src-supplier=Element14; ComponentLink11Description: http://www.farnell.com/datasheets/1678782.pdf?src-supplier=Element14; Supplier Part Number 2: P3.65KLCT-ND

## Nets that join several sheets
+3V3: [01] SYSTEM_POWER (R48.2 R50.2 TP12.1), [02] PMIC_POWER (F1.2 R46.1)
GND: [01] SYSTEM_POWER (55 pins), [02] PMIC_POWER (44 pins)
NetC9_2: [01] SYSTEM_POWER (U6.4), [02] PMIC_POWER (5 pins)
NetF2_1: [01] SYSTEM_POWER (U6.5), [02] PMIC_POWER (F2.1 R19.2)

## Assembly variants
TEST: not fitted R?